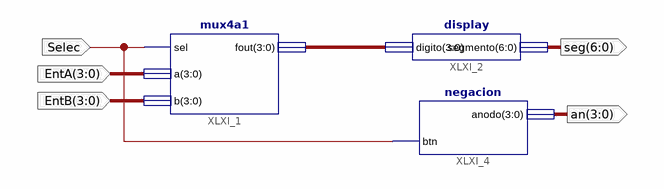
[diagram p0: schematic sheet 1]
// Xilinx ISE schematic SuperiorMuxDisplay.sch (spartan6) as structural Verilog: 3 symbols, 5 ports
module SuperiorMuxDisplay (
  input  [3:0] EntA,
  input  [3:0] EntB,
  input  Selec,
  output [6:0] seg,
  output [3:0] an
);

  wire [3:0] XLXN_5;

  mux4a1 XLXI_1 (.sel(Selec), .a(EntA), .b(EntB), .fout(XLXN_5));
  display XLXI_2 (.digito(XLXN_5), .segmento(seg));
  negacion XLXI_4 (.anodo(an), .btn(Selec));
endmodule
